# Altium schematic sheet 19_SOLEDNOID_1.SchDoc
size 420 x 297 mm; SheetNumber: 30; SheetTotal: 33
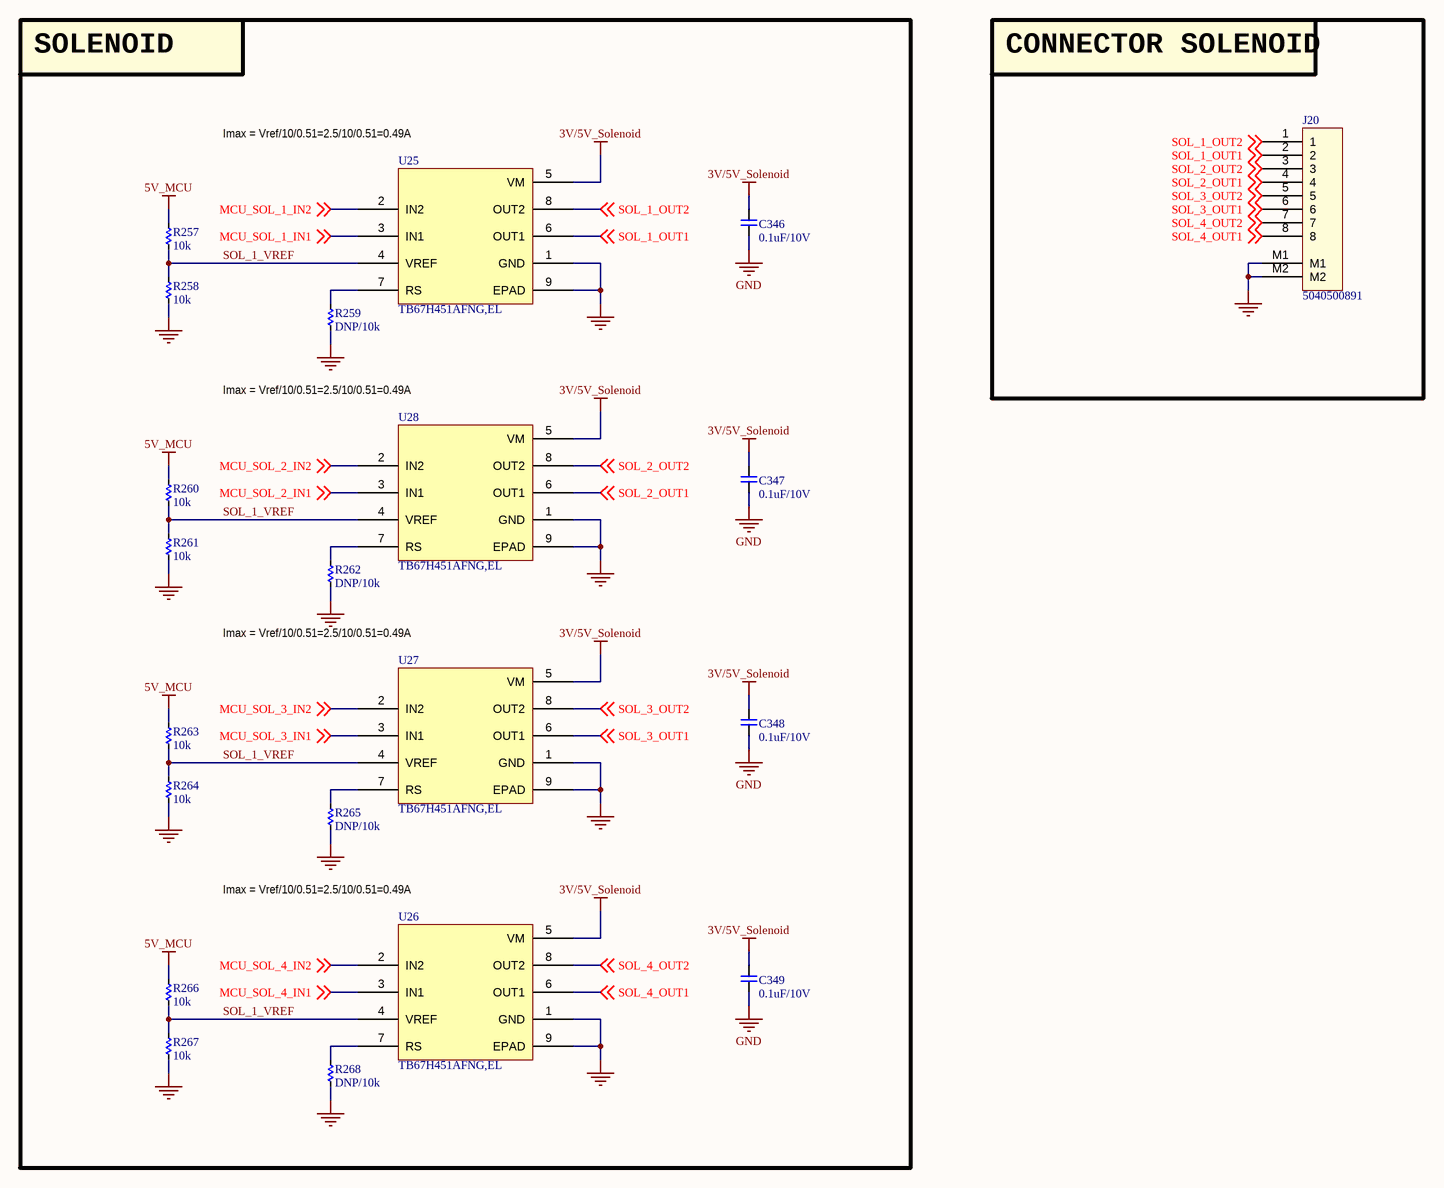
[diagram p0: 19_SOLEDNOID_1.SchDoc]

## Parts
C346  0.1uF/10V  [CAP_C_1005X50_L]
C347  0.1uF/10V  [CAP_C_1005X50_L]
C348  0.1uF/10V  [CAP_C_1005X50_L]
C349  0.1uF/10V  [CAP_C_1005X50_L]
J20  5040500891  [MOLEX_5040500891]
R257  10k  [RES_C_1005x30_L]
R258  10k  [RES_C_1005x30_L]
R259  DNP/10k  [RES_C_1005x30_L]
R260  10k  [RES_C_1005x30_L]
R261  10k  [RES_C_1005x30_L]
R262  DNP/10k  [RES_C_1005x30_L]
R263  10k  [RES_C_1005x30_L]
R264  10k  [RES_C_1005x30_L]
R265  DNP/10k  [RES_C_1005x30_L]
R266  10k  [RES_C_1005x30_L]
R267  10k  [RES_C_1005x30_L]
R268  DNP/10k  [RES_C_1005x30_L]
U25  TB67H451AFNG,EL  [SOIC127P602X173-8N_EPAD]
U26  TB67H451AFNG,EL  [SOIC127P602X173-8N_EPAD]
U27  TB67H451AFNG,EL  [SOIC127P602X173-8N_EPAD]
U28  TB67H451AFNG,EL  [SOIC127P602X173-8N_EPAD]

## Blocks framed on the sheet
SOLENOID: C346-C349 R257-R268 U25-U28
CONNECTOR SOLENOID: J20

## Nets
3V/5V_Solenoid: C346.2 C347.2 C348.2 C349.2 U25.5(VM) U26.5(VM) U27.5(VM) U28.5(VM)
5V_MCU: R257.1 R260.1 R263.1 R266.1
GND: C346.1 C347.1 C348.1 C349.1 J20.M1 J20.M2 R258.2 R259.2 R261.2 R262.2 R264.2 R265.2 R267.2 R268.2 U25.1(GND) U25.9(EPAD) U26.1(GND) U26.9(EPAD) U27.1(GND) U27.9(EPAD) U28.1(GND) U28.9(EPAD)
MCU_SOL_1_IN1: U25.3(IN1) ; off-sheet MCU_SOL_1_IN1
MCU_SOL_1_IN2: U25.2(IN2) ; off-sheet MCU_SOL_1_IN2
MCU_SOL_2_IN1: U28.3(IN1) ; off-sheet MCU_SOL_2_IN1
MCU_SOL_2_IN2: U28.2(IN2) ; off-sheet MCU_SOL_2_IN2
MCU_SOL_3_IN1: U27.3(IN1) ; off-sheet MCU_SOL_3_IN1
MCU_SOL_3_IN2: U27.2(IN2) ; off-sheet MCU_SOL_3_IN2
MCU_SOL_4_IN1: U26.3(IN1) ; off-sheet MCU_SOL_4_IN1
MCU_SOL_4_IN2: U26.2(IN2) ; off-sheet MCU_SOL_4_IN2
SOL_1_OUT1: J20.2 U25.6(OUT1) ; off-sheet SOL_1_OUT1
SOL_1_OUT2: J20.1 U25.8(OUT2) ; off-sheet SOL_1_OUT2
SOL_1_VREF: R257.2 R258.1 R260.2 R261.1 R263.2 R264.1 R266.2 R267.1 U25.4(VREF) U26.4(VREF) U27.4(VREF) U28.4(VREF)
SOL_2_OUT1: J20.4 U28.6(OUT1) ; off-sheet SOL_2_OUT1
SOL_2_OUT2: J20.3 U28.8(OUT2) ; off-sheet SOL_2_OUT2
SOL_3_OUT1: J20.6 U27.6(OUT1) ; off-sheet SOL_3_OUT1
SOL_3_OUT2: J20.5 U27.8(OUT2) ; off-sheet SOL_3_OUT2
SOL_4_OUT1: J20.8 U26.6(OUT1) ; off-sheet SOL_4_OUT1
SOL_4_OUT2: J20.7 U26.8(OUT2) ; off-sheet SOL_4_OUT2
NetR259_1: R259.1 U25.7(RS)
NetR262_1: R262.1 U28.7(RS)
NetR265_1: R265.1 U27.7(RS)
NetR268_1: R268.1 U26.7(RS)

## Notes on the sheet
- (near U25) Imax = Vref/10/0.51=2.5/10/0.51=0.49A
- Imax = Vref/10/0.51=2.5/10/0.51=0.49A
- Project:
- BEE-1012
- Sub-system:
- SATELLITE_EXP_CONTROLLER
- Design by:
- SANG HUYNH
- BAO BUI
- Sheet title:
- Sheet
- A3
- of
- Checked by:
- Approved by:
- VU PHAM
- Revision:
- Document No:
- Size:
- Date:

## Library data of the parts
C346-C349 = _CAP_C_2: CAP CHIP
J20 = Header 8x1_2M
R257-R268 = _RES_B_2: RES
U25-U28 = IC_H_bridge_TB67H451AFNG,EL: BRUSHED MOTOR DRIVER IC, 50V, 3.